# EAGLE design bancada_hx711 (EAGLE 9.0.0)
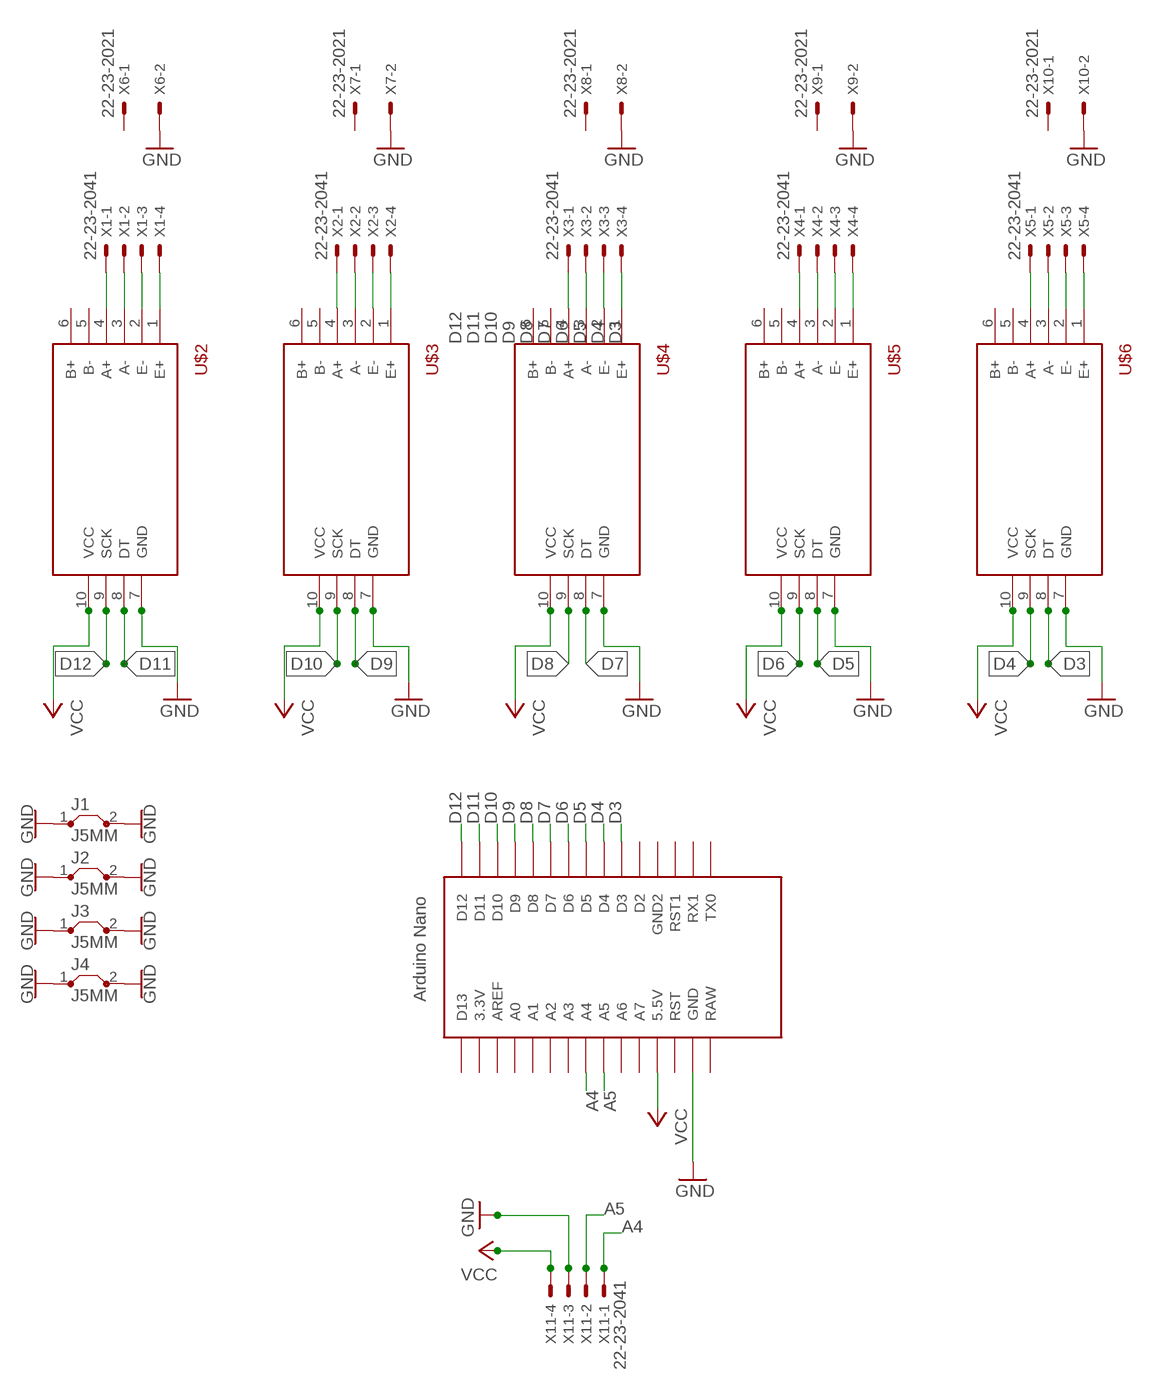
[diagram p0: schematic, sheet 1]

## Parts
J1  J5MM  [05]
J2  J5MM  [05]
J3  J5MM  [05]
J4  J5MM  [05]
U$1  NANO  [NANO]
U$2  HX711-1  [HX711-1]
U$3  HX711-1  [HX711-1]
U$4  HX711-1  [HX711-1]
U$5  HX711-1  [HX711-1]
U$6  HX711-1  [HX711-1]
X1  22-23-2041  [22-23-2041]
X2  22-23-2041  [22-23-2041]
X3  22-23-2041  [22-23-2041]
X4  22-23-2041  [22-23-2041]
X5  22-23-2041  [22-23-2041]
X6  22-23-2021  [22-23-2021]
X7  22-23-2021  [22-23-2021]
X8  22-23-2021  [22-23-2021]
X9  22-23-2021  [22-23-2021]
X10  22-23-2021  [22-23-2021]
X11  22-23-2041  [22-23-2041]

## Nets
A4: U$1.A4 X11.1
A5: U$1.A5 X11.2
D3: U$1.D3 U$6.8(DT)
D4: U$1.D4 U$6.9(SCK)
D5: U$1.D5 U$5.8(DT)
D6: U$1.D6 U$5.9(SCK)
D7: U$1.D7 U$4.8(DT)
D8: U$1.D8 U$4.9(SCK)
D9: U$1.D9 U$3.8(DT)
D10: U$1.D10 U$3.9(SCK)
D11: U$1.D11 U$2.8(DT)
D12: U$1.D12 U$2.9(SCK)
GND: J1.1 J1.2 J2.1 J2.2 J3.1 J3.2 J4.1 J4.2 U$1.GND U$2.7(GND) U$3.7(GND) U$4.7(GND) U$5.7(GND) U$6.7(GND) X6.2 X7.2 X8.2 X9.2 X10.2 X11.3
N$1: U$2.1(E+) X1.4
N$2: U$2.2(E-) X1.3
N$3: U$2.3(A-) X1.2
N$4: U$2.4(A+) X1.1
N$5: U$3.4(A+) X2.1
N$6: U$3.3(A-) X2.2
N$7: U$3.2(E-) X2.3
N$8: U$3.1(E+) X2.4
N$9: U$4.1(E+) X3.4
N$10: U$4.2(E-) X3.3
N$11: U$4.3(A-) X3.2
N$12: U$4.4(A+) X3.1
N$13: U$5.1(E+) X4.4
N$14: U$5.2(E-) X4.3
N$15: U$5.3(A-) X4.2
N$16: U$5.4(A+) X4.1
N$17: U$6.1(E+) X5.4
N$18: U$6.2(E-) X5.3
N$19: U$6.3(A-) X5.2
N$20: U$6.4(A+) X5.1
VCC: U$1.5V(5.5V) U$2.10(VCC) U$3.10(VCC) U$4.10(VCC) U$5.10(VCC) U$6.10(VCC) X11.4
Unconnected: U$1.3.3V U$1.A0 U$1.A1 U$1.A2 U$1.A3 U$1.A6 U$1.A7 U$1.AREF U$1.D2 U$1.D13 U$1.GND1(GND2) U$1.ICSP1 U$1.ICSP2 U$1.ICSP3 U$1.ICSP4 U$1.ICSP5 U$1.ICSP6 U$1.RAW U$1.RST U$1.RST1 U$1.RX1 U$1.TX0 U$2.5(B-) U$2.6(B+) U$3.5(B-) U$3.6(B+) U$4.5(B-) U$4.6(B+) U$5.5(B-) U$5.6(B+) U$6.5(B-) U$6.6(B+) X6.1 X7.1 X8.1 X9.1 X10.1

## Library data of the parts
J1-J4 = jumper:J: Bridge
U$1 = Arduino-clone:NANO: Arduino Nano
U$2-U$6 = HX711:HX711-1: Load cell amplifier board based on HX711
X1-X5 X11 = con-molex:22-23-2041: .100" (2.54mm) Center Header - 4 Pin; MF: MOLEX; MPN: 22-23-2041; OC_FARNELL: 1462920; OC_NEWARK: 38C0355
X6-X10 = con-molex:22-23-2021: .100" (2.54mm) Center Header - 2 Pin; MF: MOLEX; MPN: 22-23-2021; OC_FARNELL: 1462926; OC_NEWARK: 25C3832

## Net classes
0 default: clearance 0.205 mm

## Board
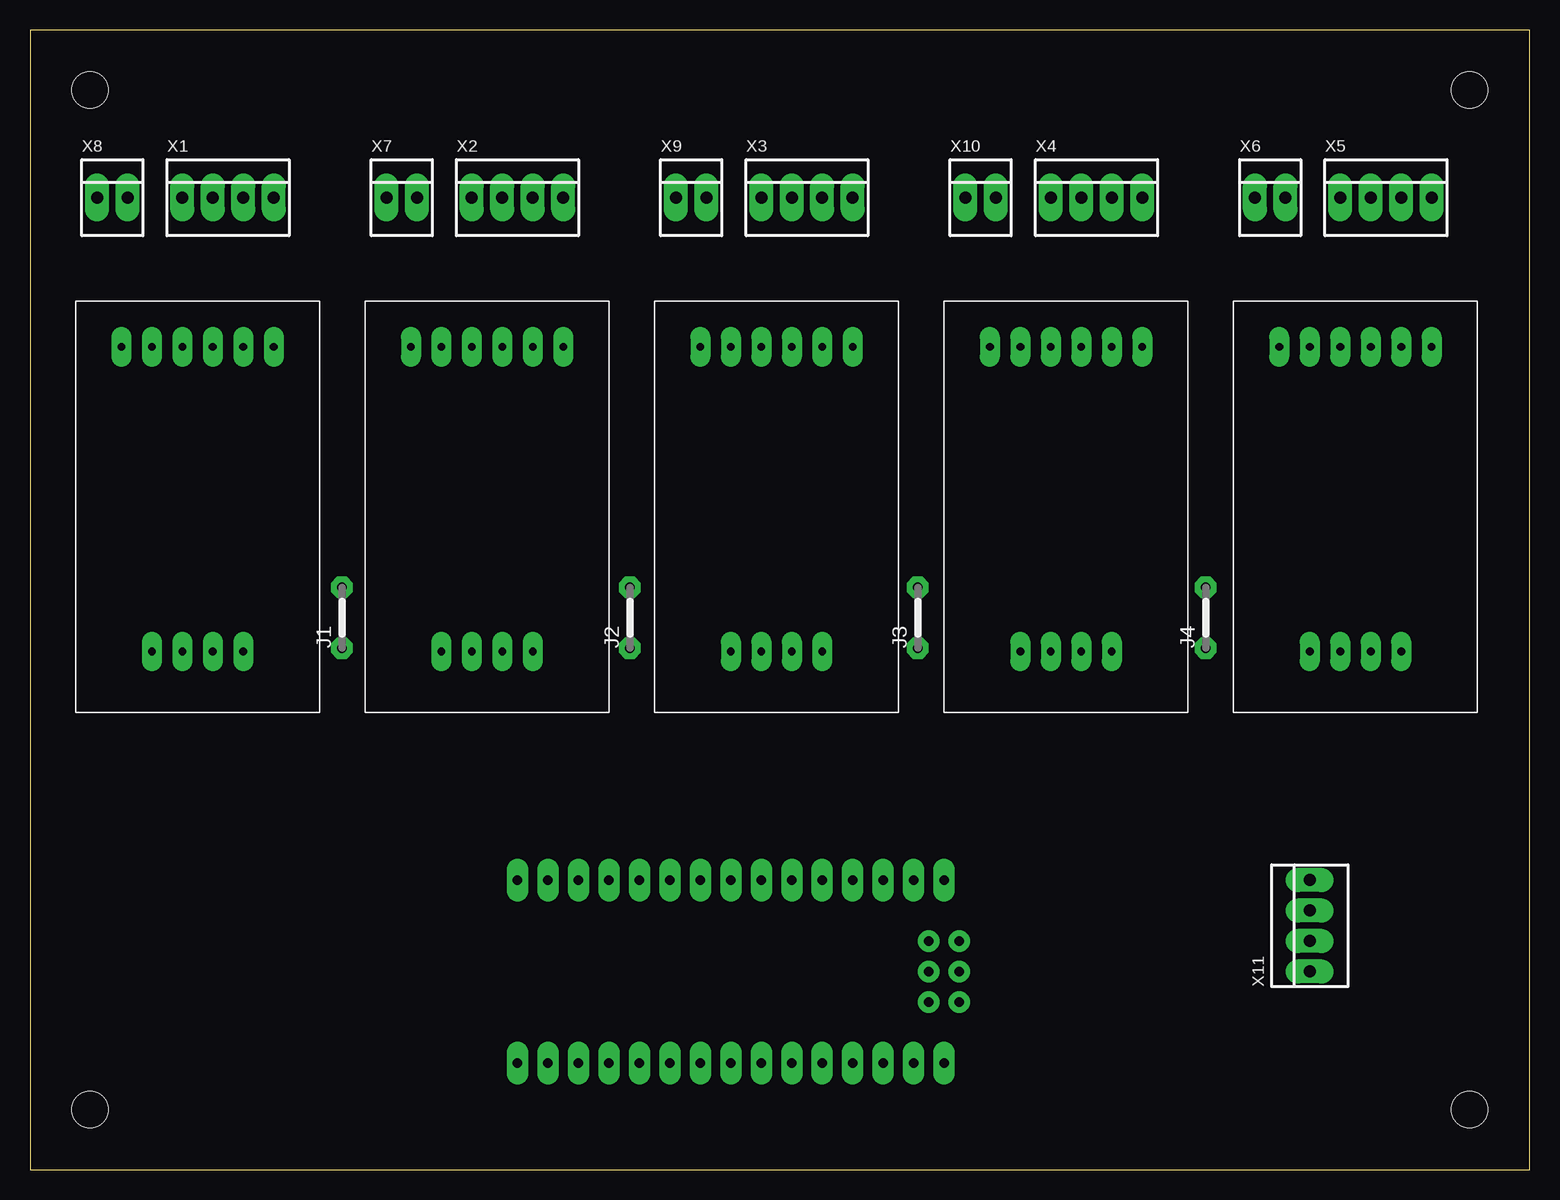
[diagram p1: board, top side]
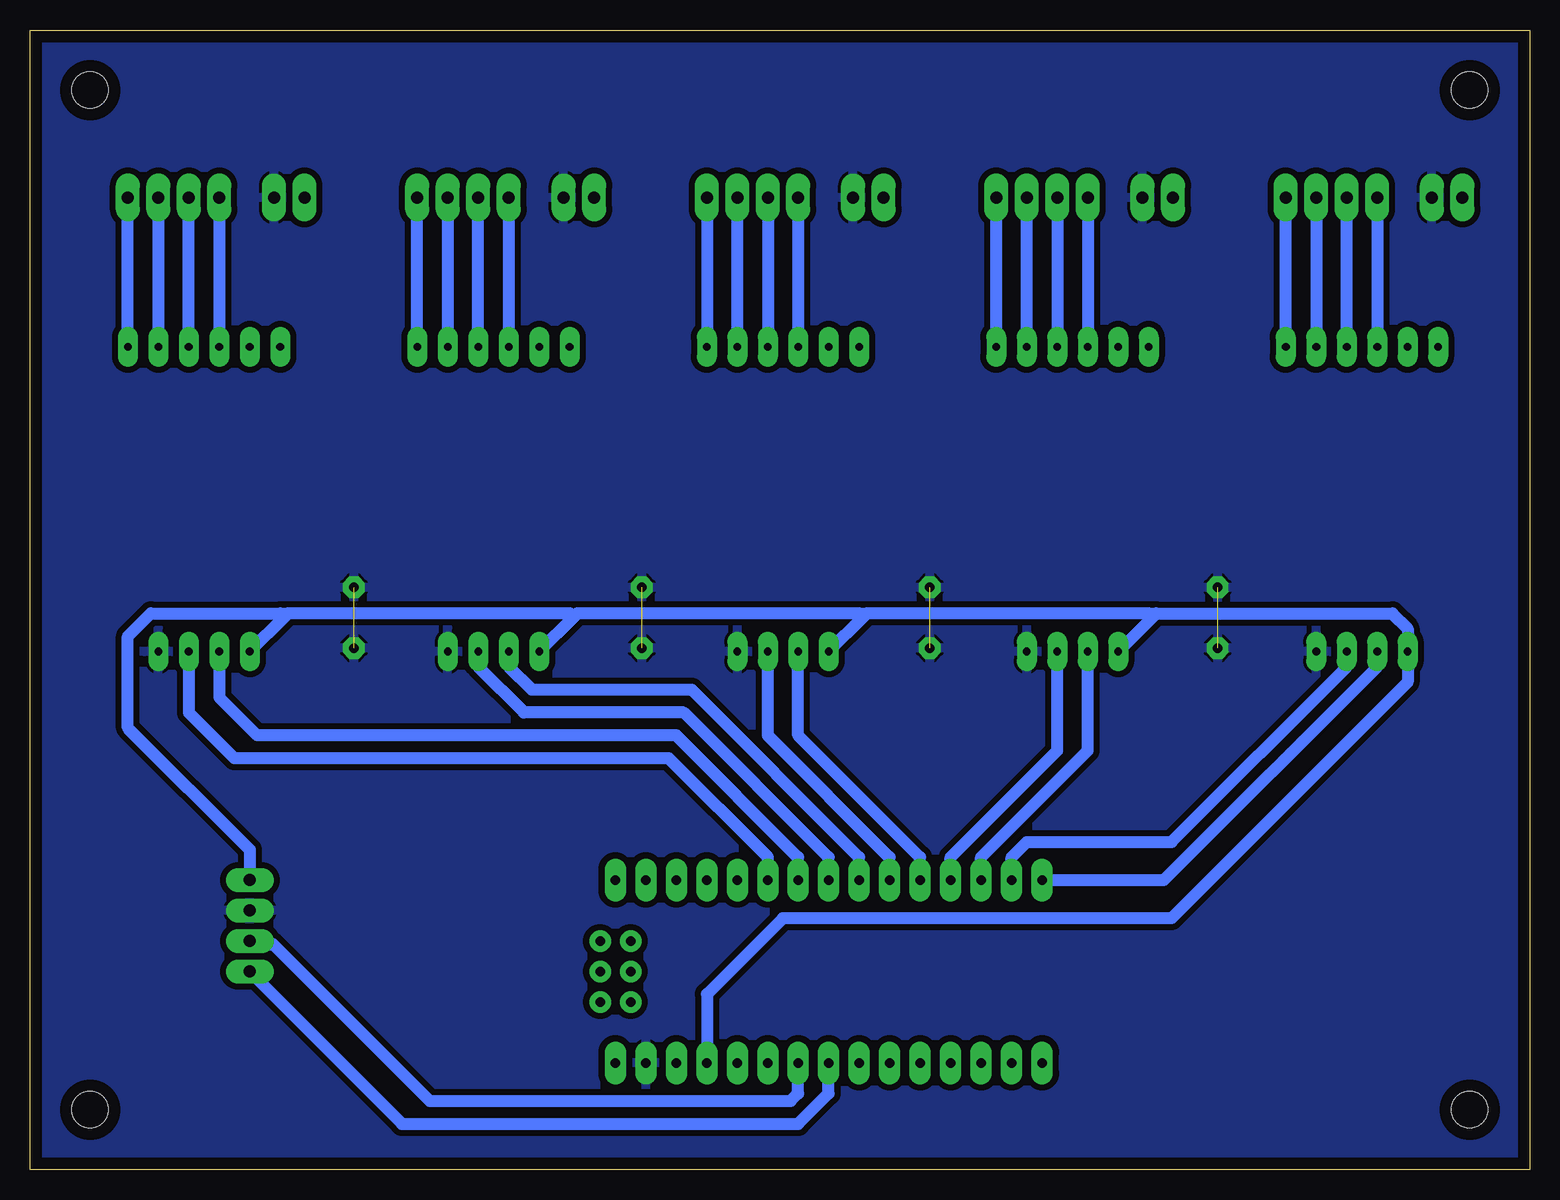
[diagram p2: board, bottom side, seen from below]

Size 125 x 95 mm. Coordinates in mm from the lower left corner, seen from the top.
Outline: 0,0 125,0 125,95 0,95 0,0
Copper layers (1*16): Top 0.035mm / dielectric 1.5mm / Bottom 0.035mm
Design rules "drc_inep": minimum track width 20mil, minimum drill 0.2mm, track to track 20mil, track to pad 20mil, pad to pad 20mil, via to via 20mil, smd to smd 20mil, copper to edge 1mm, drill to drill 1.5mm, minimum pad ring 0.5mm, minimum via ring 0.5mm, stop-mask expansion 4mil, vias tented up to drill 0mil, thermal gap 10mil
Holes 3 mm at 5,5 120,5 120,90 5,90

### Footprints (pad centres in the part's own frame; a part is rotated, then mirrored left to right if it is on the bottom)
05 = drill 0.813 pad 1.6 octagon: 1 -2.54,0; 2 2.54,0
NANO = drill 0.8 long: 3.3V -10.16,24.13; 5V -10.16,-1.27; A0 -10.16,19.05; A1 -10.16,16.51; A2 -10.16,13.97; A3 -10.16,11.43; A4 -10.16,8.89; A5 -10.16,6.35; A6 -10.16,3.81; A7 -10.16,1.27; AREF -10.16,21.59; D2 5.08,1.27; D3 5.08,3.81; D4 5.08,6.35; D5 5.08,8.89; D6 5.08,11.43; D7 5.08,13.97; D8 5.08,16.51; D9 5.08,19.05; D10 5.08,21.59; D11 5.08,24.13; D12 5.08,26.67; D13 -10.16,26.67; GND -10.16,-6.35; GND1 5.08,-1.27; RAW -10.16,-8.89; RST -10.16,-3.81; RST1 5.08,-3.81; RX1 5.08,-6.35; TX0 5.08,-8.89 | drill 0.8: ICSP1 -5.08,-10.16; ICSP2 -5.08,-7.62; ICSP3 -2.54,-10.16; ICSP4 -2.54,-7.62; ICSP5 0,-10.16; ICSP6 0,-7.62
HX711-1 = drill 0.65 long: 1 3.81,16.51; 2 3.81,13.97; 3 3.81,11.43; 4 3.81,8.89; 5 3.81,6.35; 6 3.81,3.81; 7 29.21,13.97; 8 29.21,11.43; 9 29.21,8.89; 10 29.21,6.35
22-23-2041 = drill 1 long: 1 -3.81,0; 2 -1.27,0; 3 1.27,0; 4 3.81,0
22-23-2021 = drill 1 long: 1 -1.27,0; 2 1.27,0

### Placement (x,y rotation side)
J1  26,46 90 top
J2  50,46 90 top
J3  74,46 90 top
J4  98,46 90 top
U$1  67.31,19.05 90 top
U$2  3.81,72.39 270 top
U$3  27.94,72.39 270 top
U$4  52.07,72.39 270 top
U$5  76.2,72.39 270 top
U$6  100.33,72.39 270 top
X1  16.51,81.03 0 top
X2  40.64,81.03 0 top
X3  64.77,81.03 0 top
X4  88.9,81.03 0 top
X5  113.03,81.03 0 top
X6  103.38,81.03 0 top
X7  30.99,81.03 0 top
X8  6.86,81.03 0 top
X9  55.12,81.03 0 top
X10  79.25,81.03 0 top
X11  106.68,20.32 90 top

### Tracks (layer width: path | path; a pad name or v marks a point on that pad's centre or on a via)
A4
  Bottom 1: X11.1 93.98,3.81 60.96,3.81 58.42,6.35 U$1.A4
A5
  Bottom 1: X11.2 106.4,18.77 104.74,18.77 91.69,5.71 61.59,5.71 60.96,6.35 U$1.A5
D3
  Bottom 1: U$6.8 111.76,38.1 107.95,34.29 71.75,34.29 63.5,26.04 U$1.D3
D4
  Bottom 1: U$6.9 109.22,39.37 106.05,36.2 71.12,36.2 60.96,26.04 U$1.D4
D5
  Bottom 1: U$5.8 87.63,41.91 83.82,38.1 70.48,38.1 58.42,26.04 U$1.D5
D6
  Bottom 1: U$1.D6 55.88,26.04 69.85,40.01 83.15,40.01 85.09,41.94 U$5.9
D7
  Bottom 1: U$1.D7 53.34,26.04 63.5,36.2 U$4.8
D8
  Bottom 1: U$4.9 60.96,36.2 50.8,26.04 U$1.D8
D9
  Bottom 1: U$1.D9 48.26,26.04 39.37,34.92 U$3.8
D10
  Bottom 1: U$1.D10 45.72,26.04 36.83,34.92 U$3.9
D11
  Bottom 1: U$2.8 15.24,41.91 29.84,27.3 41.91,27.3 43.18,26.04 U$1.D11
D12
  Bottom 1: U$1.D12 30.48,24.13 12.7,41.91 U$2.9
GND  (4 unrouted)
  pour Bottom: -5.08,100.68 128.27,100.68 128.27,-2.54 -5.08,-2.54
N$1
  Bottom 1: U$2.1 X1.4
N$2
  Bottom 1: X1.3 U$2.2
N$3
  Bottom 1: U$2.3 X1.2
N$4
  Bottom 1: X1.1 U$2.4
N$5
  Bottom 1: X2.1 U$3.4
N$6
  Bottom 1: X2.2 U$3.3
N$7
  Bottom 1: U$3.2 X2.3
N$8
  Bottom 1: U$3.1 X2.4
N$9
  Bottom 1: X3.4 U$4.1
N$10
  Bottom 1: U$4.2 X3.3
N$11
  Bottom 1: X3.2 U$4.3
N$12
  Bottom 1: X3.1 U$4.4
N$13
  Bottom 1: U$5.1 X4.4
N$14
  Bottom 1: X4.3 U$5.2
N$15
  Bottom 1: U$5.3 X4.2
N$16
  Bottom 1: X4.1 U$5.4
N$17
  Bottom 1: U$6.1 X5.4
N$18
  Bottom 1: X5.3 U$6.2
N$19
  Bottom 1: U$6.3 X5.2
N$20
  Bottom 1: X5.1 U$6.4
VCC
  Bottom 1: 31.11,46.35 11.43,46.35 10.16,45.09 U$2.10 10.16,40.64 29.84,20.95 62.23,20.95 68.58,14.61 U$1.5V | U$3.10 31.43,46.04 | 31.11,46.35 31.43,46.04 | 55.24,46.35 55.56,46.04 | 55.56,46.04 U$4.10 | 31.75,46.35 55.24,46.35 | 31.75,46.35 31.43,46.04 | 79.69,46.04 79.38,46.35 55.88,46.35 | 79.69,46.04 U$5.10 | 55.88,46.35 55.56,46.04 | 103.5,46.35 103.82,46.04 | 103.82,46.04 U$6.10 | 103.5,46.35 102.87,46.35 80.01,46.35 79.69,46.04 | 104.14,46.35 103.82,46.04 | 104.14,46.35 114.94,46.35 116.84,44.45 116.84,36.83 106.68,26.67 X11.4 | 31.75,46.35 31.11,46.35 | 55.88,46.35 55.24,46.35 | 104.14,46.35 103.5,46.35